# Altium schematic sheet USB.SchDoc
size Letter; DocumentNumber: 2; SheetNumber: 2; SheetTotal: 8
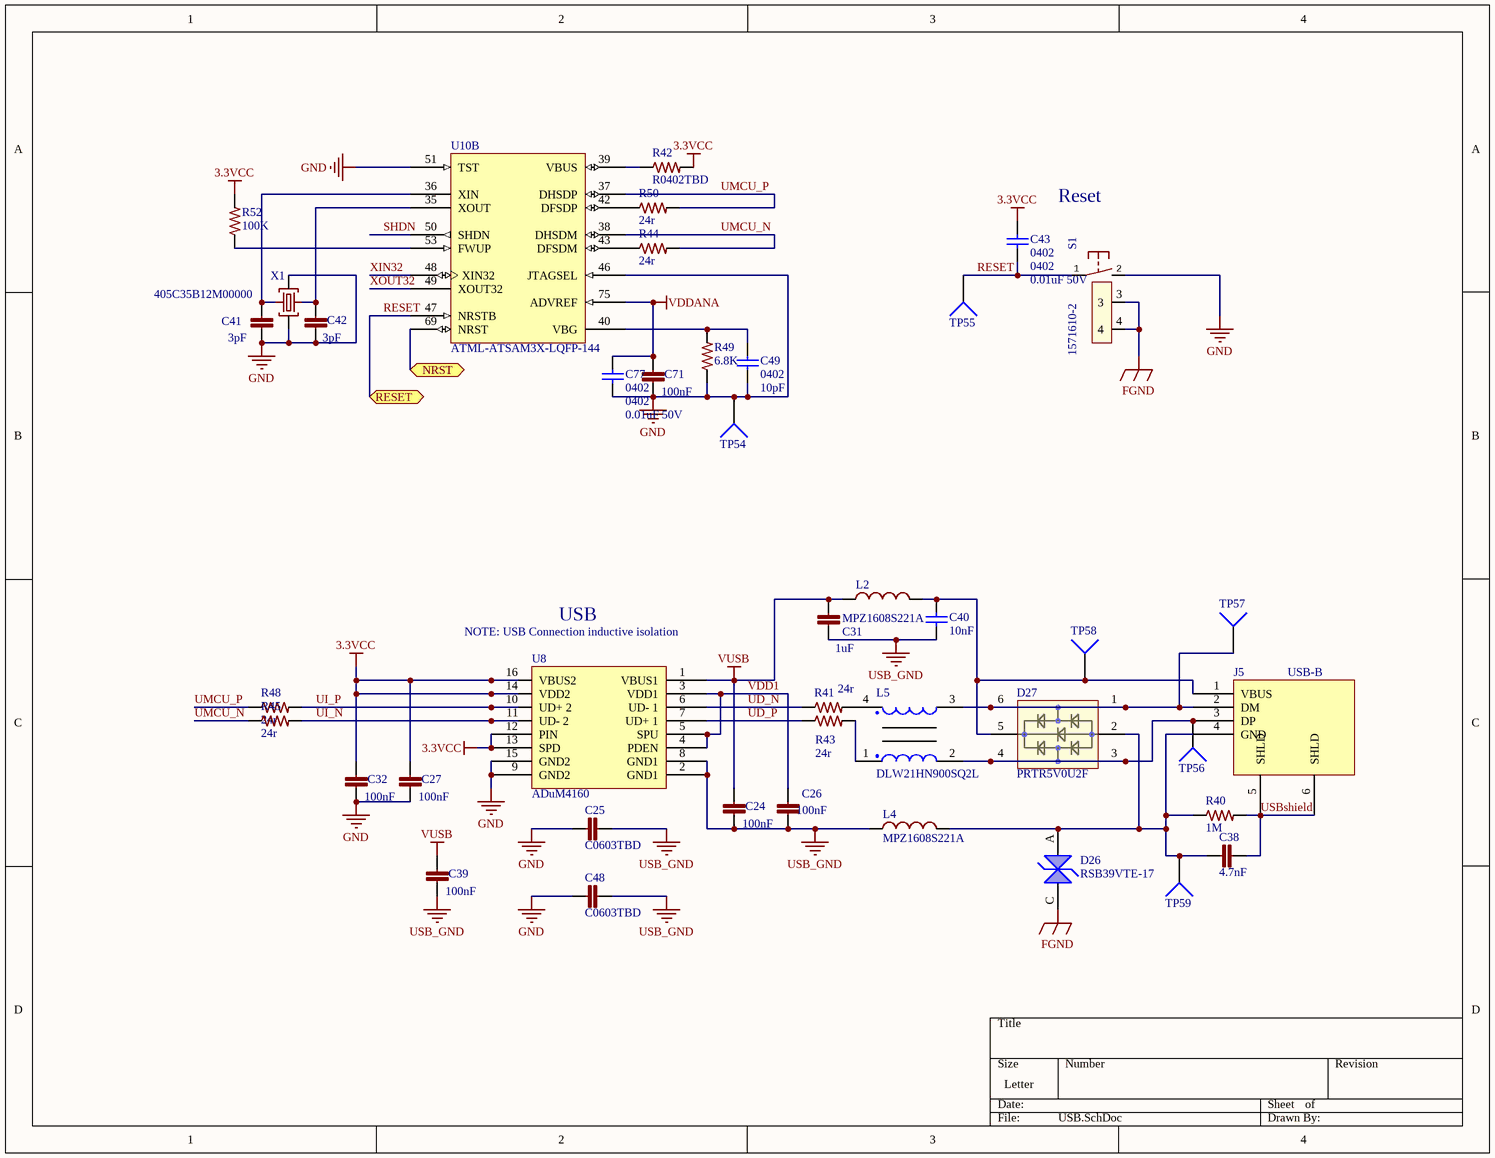
[diagram p0: USB.SchDoc]

## Parts
C24  100nF  [C0402]
C25  C0603TBD  [C0603]
C26  100nF  [C0402]
C27  100nF  [C0402]
C31  1uF  [C0402]
C32  100nF  [C0402]
C38  4.7nF  [C0402]
C39  100nF  [C0402]
C40  10nF  [C0402]
C41  3pF  [C0603]
C42  3pF  [C0603]
C43  0402  value 0.01uF 50V  [C0402]
C48  C0603TBD  [C0603]
C49  0402  value 10pF  [C0402]
C71  100nF  [C0402]
C77  0402  value 0.01uF 50V  [C0402]
D26  RSB39VTE-17  [SOD323-R]
D27  PRTR5V0U2F  [SOT886]
J5  USB-B  [PN61729]
L2  MPZ1608S221A  [C0603]
L4  MPZ1608S221A  [C0603]
L5  DLW21HN900SQ2L  [DLW21HN900SQ2L]
R40  1M  [R0402]
R41  24r  [R0402]
R42  R0402TBD  [R0402]
R43  24r  [R0402]
R44  24r  [R0402]
R45  24r  [R0402]
R48  24r  [R0402]
R49  6.8K  [R0402]
R50  24r  [R0402]
R52  100K  [R0402]
S1  1571610-2  [B3F-31XX]
TP54  TP4  [TP-2]  (value not drawn)
TP55  TP4  [TP-2]  (value not drawn)
TP56  TP4  [TP-2]  (value not drawn)
TP57  TP4  [TP-2]  (value not drawn)
TP58  TP4  [TP-2]  (value not drawn)
TP59  TP4  [TP-2]  (value not drawn)
U8  ADuM4160  [ADuM4160]
U10  ATML-ATSAM3X-LQFP-144  [LQFP144_N]  (part B of 3)
X1  405C35B12M00000  [CRYS320500]

## Ports
NRST, RESET

## Nets
3.3VCC: C27.1 C32.1 C43.2 R42.2 R52.2 U8.12(PIN) U8.13(SPD) U8.14(VDD2) U8.16(VBUS2)
FGND: D26.C S1.3 S1.4
GND: C25.2 C27.2 C32.2 C41.2 C42.2 C48.2 C49.2 C71.2 C77.2 R49.1 S1.2(S) TP54.1 U8.9(GND2) U8.15(GND2) U10.46(JTAGSEL) U10.51(TST) X1.2(GND) X1.4(GND)
USB_GND: C24.2 C25.1 C26.2 C31.2 C39.2 C40.1 C48.1 L4.1 U8.2(GND1) U8.8(GND1)
VDDANA: C71.1 C77.1 U10.75(ADVREF)
VUSB: C24.1 C31.1 C39.1 L2.1 U8.1(VBUS1)
NRST: U10.69(NRST) ; port NRST
RESET: C43.1 S1.1(P) TP55.1 U10.47(NRSTB) ; port RESET
SHDN: U10.50(SHDN)
UD_N: R41.1 U8.6(UD-_1)
UD_P: R43.1 U8.7(UD+_1)
UI_N: R45.2 U8.11(UD-_2)
UI_P: R48.2 U8.10(UD+_2)
UMCU_N: R44.2 R45.1 U10.38(DHSDM)
UMCU_P: R48.1 R50.2 U10.37(DHSDP)
USBshield: C38.1 J5.5(SHLD) J5.6(SHLD) R40.2
VDD1: C26.1 U8.3(VDD1) U8.4(PDEN) U8.5(SPU)
XIN32: U10.48(XIN32)
XOUT32: U10.49(XOUT32)
NetC38_2: C38.2 D26.A D27.2 J5.4(GND) L4.2 R40.1 TP59.1
NetC40_2: C40.2 D27.5 J5.1(VBUS) L2.2 TP58.1
NetC41_1: C41.1 U10.36(XIN) X1.1(C1)
NetC42_1: C42.1 U10.35(XOUT) X1.3(C2)
NetC49_1: C49.1 R49.2 U10.40(VBG)
NetD27_1: D27.1 D27.6 J5.2(DM) L5.3 TP57.1
NetD27_3: D27.3 D27.4 J5.3(DP) L5.2 TP56.1
NetL5_1: L5.1 R43.2
NetL5_4: L5.4 R41.2
NetR42_1: R42.1 U10.39(VBUS)
NetR44_1: R44.1 U10.43(DFSDM)
NetR50_1: R50.1 U10.42(DFSDP)
NetR52_1: R52.1 U10.53(FWUP)

## Notes on the sheet
- Reset
- (near U8) NOTE: USB Connection inductive isolation
- USB

## Library data of the parts
C24 C26 C27 C32 C39 C71 = GRM155R71C104KA88D: CAP CER 0402 100nF 16V 10% X7R; LastRevisionNote: ImportComponents; Published: 23-Apr-2014; Publisher: UltiMachine; LastRevisionDate: 23-Apr-2014; ManufacturerPartNumber: GRM155R71C104KA88D; VALUE: 100nF
C25 C48 = C0603TBD: Capacitor Non Polarized; LastRevisionNote: ImportComponents; Published: 23-Apr-2014; Publisher: UltiMachine; LastRevisionDate: 23-Apr-2014; VALUE: C0603TBD
C31 = GRM155R60J105KE19D: CAP CER 0402 1uF 6.3V 10% X5R; LastRevisionNote: ImportComponents; Published: 23-Apr-2014; Publisher: UltiMachine; LastRevisionDate: 23-Apr-2014; ManufacturerPartNumber: GRM155R60J105KE19D; VALUE: 1uF
C38 = CC0402KRX7R8BB472: CAP CER 0402 4.7nF 25V 10% X7R; LastRevisionNote: ImportComponents; Published: 23-Apr-2014; Publisher: UltiMachine; VALUE: 4.7nF; LastRevisionDate: 23-Apr-2014; ManufacturerPartNumber: CC0402KRX7R8BB472
C40 C43 = GRM155R71H103JA88D: CAP CER 10nF 50V X7R 0402; MFR: Murata; Part Description: CAP CER 10000PF 50V X7R 0402; Tolerance: 10%; Voltage: 6.3VDC; Published: 10 - Dec - 2014; LatestRevisionDate: 10 - Dec - 2014; LatestRevisionNote: Ultimachine Footprint Added; Publisher: Ultimachine; Component Type: Chip Capacitor; MFR Part #: GRM155R71H103JA88D; Mounting Type: SMT 0402; Datasheet: http://search.murata.co.jp/Ceramy/image/img/A01X/G101/ENG/GRM155R71H103JA88-01.pdf; Height: 0.5 ±0.05mm; Digikey #: 490-7763-1-ND; PackageReference: 0402
  C40: Value: 10nF
C41 C42 = CL10C030BB8NNND: CAP CER 3PF 50V NP0 0603; LastRevisionNote: ImportComponents; Published: 23-Apr-2014; Publisher: UltiMachine; VALUE: 3pF; LastRevisionDate: 23-Apr-2014; ManufacturerPartNumber: CL10C030BB8NNND
C49 = CL05C100JB5NNNC: CAP CER 10PF 50V 5% NP0 0402; MFR: Samsung; Tolerance: 10%; Voltage: 50VDC; Published: 10 - Dec - 2014; LatestRevisionDate: 10 - Dec - 2014; LatestRevisionNote: Ultimachine Footprint Added; Publisher: Ultimachine; Component Type: Chip Capacitor; MFR Part #: CL05C100JB5NNNC; Part Description: CAP CER 10PF 50V 5% NP0 0402; Mounting Type: SMT 0402; Datasheet: http://www.samsungsem.com/kr/front/downloadcms.do?path=/kr/support/product-search/mlcc/__icsFiles/afieldfile/2014/11/05&fileName=S_CL05C100JB5NNNC.pdf; Height: 0.55mm; PackageReference: 0402
C77 = GRM155R71H103JA88D: CAP CER 10000PF 50V X7R 0402; MFR: Murata; Tolerance: 10%; Voltage: 6.3VDC; Published: 10 - Dec - 2014; LatestRevisionDate: 10 - Dec - 2014; LatestRevisionNote: Ultimachine Footprint Added; Publisher: Ultimachine; Component Type: Chip Capacitor; MFR Part #: GRM155R71H103JA88D; Part Description: CAP CER 10000PF 50V X7R 0402; Mounting Type: SMT 0402; Datasheet: http://search.murata.co.jp/Ceramy/image/img/A01X/G101/ENG/GRM155R71H103JA88-01.pdf; Height: 0.5 ±0.05mm; Digikey #: 490-7763-1-ND; PackageReference: 0402
D26 = RSB39VTE-17: DIODE TVS
D27 = PRTR5V0U2F: Rail-to-rail ESD protection devices
L2 L4 = MPZ1608S221A: Ferrite; LastRevisionNote: ImportComponents; Published: 23-Apr-2014; Publisher: UltiMachine; LastRevisionDate: 23-Apr-2014; Value: MPZ1608S221A
L5 = DLW21HN900SQ2L: Common Mode Chokes Dual 90Ohm 100MHz 330mA 350mOhm DCR SMD
R40 = ERJ2GEJ105X: RES 0402 1M 100mW 5%; LastRevisionNote: ImportComponents; Published: 23-Apr-2014; Publisher: UltiMachine; LastRevisionDate: 23-Apr-2014; ManufacturerPartNumber: ERJ2GEJ105X; VALUE: 1M
R41 R43-R45 R48 R50 = CRCW040224R0FKED: Res Thick Film 0402 24 Ohm 1% 0.063W; ManufacturerPartNumber: CRCW0402200KFKED; LastRevisionNote: ImportComponents; Published: 23-Apr-2014; Publisher: UltiMachine; LastRevisionDate: 23-Apr-2014; VALUE: 24r
R42 = R0402TBD: Resistor; LastRevisionNote: ImportComponents; Published: 23-Apr-2014; Publisher: UltiMachine; LastRevisionDate: 23-Apr-2014; VALUE: R0402TBD
R49 = CRCW04026K80FKED: RES SMD 6.8K OHM 1% 1/16W 0402; Manufacturer: Vishay Dale; LastRevisionNote: ImportComponents; Published: 23-Apr-2014; Publisher: UltiMachine; LastRevisionDate: 23-Apr-2014; ManufacturerPartNumber: CRCW04026K80FKED; Height: 0.4mm; VALUE: 6.8K
R52 = RC1005F104CS: RES SMD 100K OHM 1% 1/16W 0402; Manufacturer: Samsung; LastRevisionNote: ImportComponents; Digilkey #: 1276-3432-1-ND; Published: 23-Apr-2014; Publisher: UltiMachine; LastRevisionDate: 23-Apr-2014; ManufacturerPartNumber: RC1005F104CS; VALUE: 100K
S1 = 1571610-2: SWTCH Momentary Washable; Manufacturer: TE; LastRevisionNote: Import; ComponentLink1URL: http://www.te.com/commerce/DocumentDelivery/DDEController?Action=srchrtrv&DocNm=1571610&DocType=Customer+Drawing&DocLang=English; ComponentLink1Description: Datasheet for B3F-31XX; Published: 23-Apr-2014; Publisher: UltiMachine; LastRevisionDate: 23-Apr-2014; ManufacturerPartNumber: 1571610-2; Supplier 1: Mouser; Supplier Part Number 1: 506-1571610-2
TP54-TP59 = Socket: LatestRevisionDate: 17-Jul-2002; LatestRevisionNote: Re-released for DXP Platform.; Publisher: Altium Limited
U8 = ADuM4160: USB Opto Isolator
X1 = 405C35B12M00000: Crystal 12MHz ±30ppm (Tol) ±50ppm (Stability) 13pF FUND 50Ohm; LastRevisionNote: ImportComponents; Published: 23-Apr-2014; Publisher: UltiMachine; LastRevisionDate: 23-Apr-2014; ManufacturerPartNumber: 405C35B12M00000